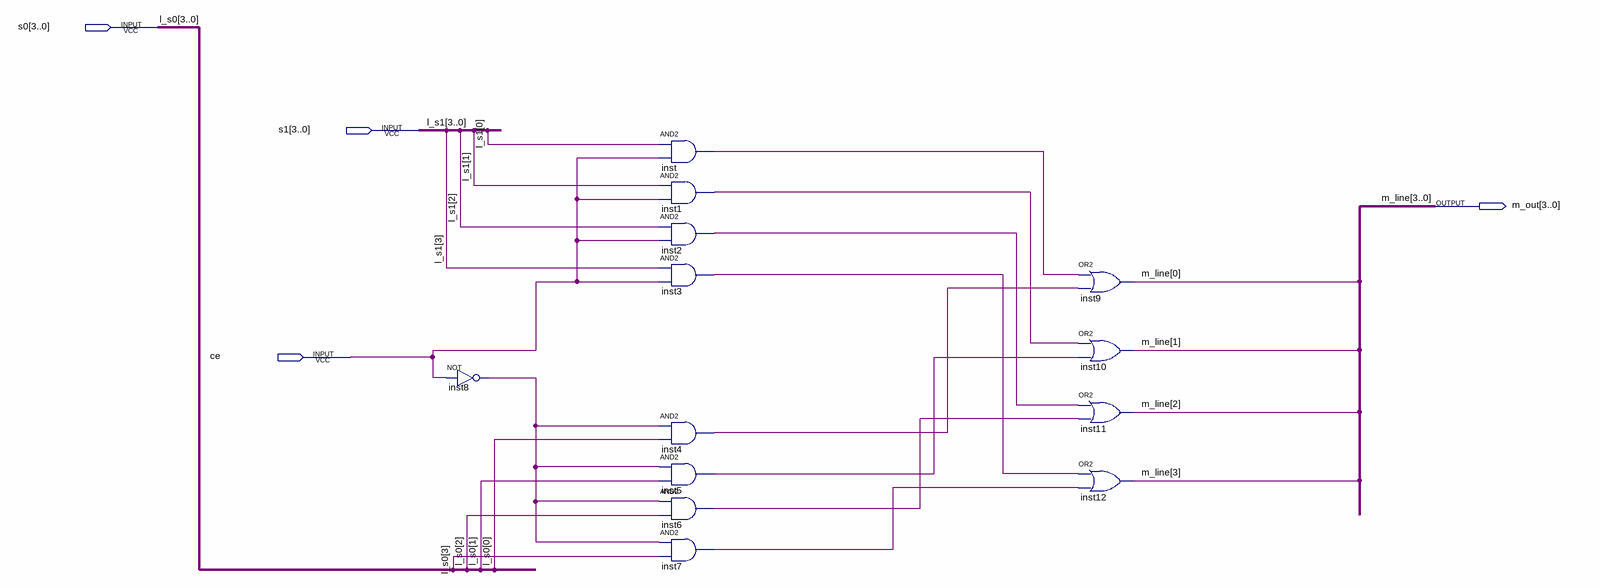
[diagram p0: schematic sheet]
// Quartus schematic mx_4bit_2x1.bdf as structural Verilog: 13 symbols, 4 pins
module mx_4bit_2x1 (
  input  [3:0] s0,
  input  [3:0] s1,
  input  ce,
  output [3:0] m_out
);

  wire inst1_out, inst2_out, inst3_out, inst4_out, inst5_out, inst6_out, inst7_out, inst8_out, inst_out;

  not inst8 (inst8_out, ce);
  and inst (inst_out, s1[0], ce);
  and inst1 (inst1_out, s1[1], ce);
  and inst2 (inst2_out, s1[2], ce);
  and inst3 (inst3_out, s1[3], ce);
  and inst4 (inst4_out, inst8_out, s0[0]);
  and inst5 (inst5_out, inst8_out, s0[1]);
  and inst6 (inst6_out, inst8_out, s0[2]);
  and inst7 (inst7_out, inst8_out, s0[3]);
  or inst9 (m_out[0], inst_out, inst4_out);
  or inst10 (m_out[1], inst1_out, inst5_out);
  or inst11 (m_out[2], inst2_out, inst6_out);
  or inst12 (m_out[3], inst3_out, inst7_out);

  // Other names for the same wires on the sheet: l_s0[3:0] = s0; l_s1[3:0] = s1; m_line[3:0] = m_out
endmodule
